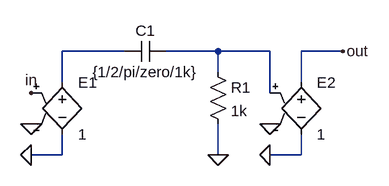
[diagram p0: schematic zero.asc]
zero.asc, the LTspice schematic file:
Version 4
SHEET 1 880 680
WIRE 336 64 240 64
WIRE 480 64 400 64
WIRE 560 64 480 64
WIRE 672 64 608 64
WIRE 480 96 480 64
WIRE 240 112 240 64
WIRE 608 112 608 64
WIRE 560 128 560 64
WIRE 240 224 240 192
WIRE 240 224 192 224
WIRE 480 224 480 176
WIRE 608 224 608 192
WIRE 608 224 560 224
FLAG 192 128 in
FLAG 192 224 0
FLAG 672 64 out
FLAG 192 176 0
FLAG 480 224 0
FLAG 560 224 0
FLAG 560 176 0
SYMBOL e 240 96 R0
SYMATTR InstName E1
SYMATTR Value 1
SYMBOL res 464 80 R0
SYMATTR InstName R1
SYMATTR Value 1k
SYMBOL cap 400 48 R90
WINDOW 0 0 32 VBottom 2
WINDOW 3 32 32 VTop 2
SYMATTR InstName C1
SYMATTR Value {1/2/pi/zero/1k}
SYMBOL e 608 96 R0
SYMATTR InstName E2
SYMATTR Value 1

The netlist it stands for:
* zero.asc
E1 N001 0 in 0 1
R1 N002 0 1k
C1 N002 N001 {1/2/pi/zero/1k}
E2 out 0 N002 0 1
.backanno
.end